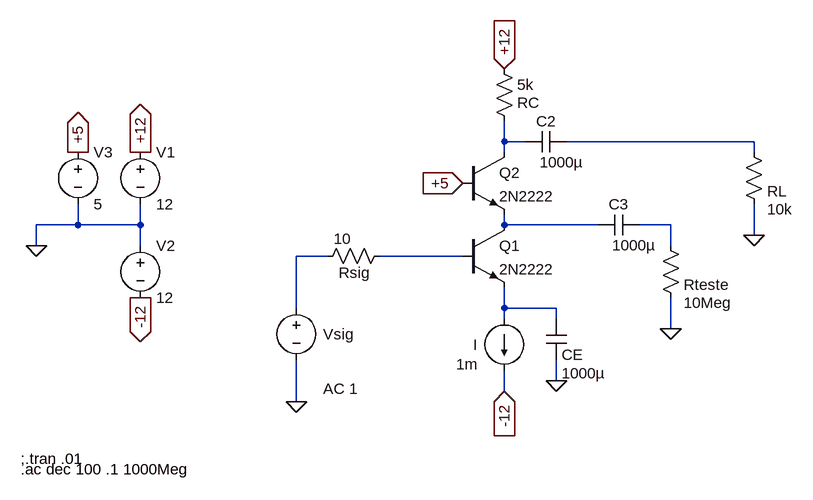
[diagram p0: schematic Cascode TBJ.asc]
Cascode TBJ.asc, the LTspice schematic file:
Version 4
SHEET 1 880 680
WIRE 272 -48 272 -80
WIRE 304 -48 272 -48
WIRE 656 -48 368 -48
WIRE 272 -32 272 -48
WIRE 656 -32 656 -48
WIRE -384 80 -384 48
WIRE -384 80 -448 80
WIRE -288 80 -288 48
WIRE -288 80 -384 80
WIRE 272 80 272 64
WIRE 416 80 272 80
WIRE 528 80 480 80
WIRE 656 96 656 48
WIRE -448 112 -448 80
WIRE -288 112 -288 80
WIRE 528 112 528 80
WIRE 0 128 -48 128
WIRE 208 128 80 128
WIRE -48 208 -48 128
WIRE 272 208 272 176
WIRE 352 208 272 208
WIRE 272 224 272 208
WIRE 352 224 352 208
WIRE 528 240 528 192
WIRE 352 320 352 288
WIRE 272 336 272 304
WIRE -48 352 -48 288
FLAG -48 352 0
FLAG 352 320 0
FLAG 656 96 0
FLAG -448 112 0
FLAG -288 -32 +12
IOPIN -288 -32 Out
FLAG -288 192 -12
IOPIN -288 192 Out
FLAG 272 336 -12
IOPIN 272 336 In
FLAG 272 -160 +12
IOPIN 272 -160 In
FLAG -384 -32 +5
IOPIN -384 -32 Out
FLAG 208 16 +5
IOPIN 208 16 In
FLAG 528 240 0
SYMBOL voltage -48 192 R0
WINDOW 0 41 56 Left 2
WINDOW 3 41 112 Left 2
WINDOW 123 41 140 Left 2
WINDOW 39 0 0 Left 0
SYMATTR InstName Vsig
SYMATTR Value ""
SYMATTR Value2 AC 1
SYMBOL res 96 112 R90
WINDOW 0 57 55 VBottom 2
WINDOW 3 -26 73 VTop 2
SYMATTR InstName Rsig
SYMATTR Value 10
SYMBOL cap 336 224 R0
WINDOW 0 24 56 Left 2
WINDOW 3 24 84 Left 2
SYMATTR InstName CE
SYMATTR Value 1000µ
SYMBOL cap 368 -64 R90
WINDOW 0 0 32 VBottom 2
WINDOW 3 32 8 VTop 2
SYMATTR InstName C2
SYMATTR Value 1000µ
SYMBOL res 256 -176 R0
WINDOW 3 36 40 Left 2
WINDOW 0 36 68 Left 2
SYMATTR Value 5k
SYMATTR InstName RC
SYMBOL res 640 -48 R0
WINDOW 0 36 76 Left 2
WINDOW 3 36 104 Left 2
SYMATTR InstName RL
SYMATTR Value 10k
SYMBOL npn 208 80 R0
SYMATTR InstName Q1
SYMATTR Value 2N2222
SYMBOL npn 208 -32 R0
SYMATTR InstName Q2
SYMATTR Value 2N2222
SYMBOL current 272 224 R0
WINDOW 0 -48 40 Left 2
WINDOW 3 -74 70 Left 2
WINDOW 123 0 0 Left 0
WINDOW 39 0 0 Left 0
SYMATTR InstName I
SYMATTR Value 1m
SYMBOL voltage -288 -48 R0
WINDOW 123 0 0 Left 0
WINDOW 39 0 0 Left 0
SYMATTR InstName V1
SYMATTR Value 12
SYMBOL voltage -288 96 R0
WINDOW 123 0 0 Left 0
WINDOW 39 0 0 Left 0
SYMATTR InstName V2
SYMATTR Value 12
SYMBOL voltage -384 -48 R0
WINDOW 123 0 0 Left 0
WINDOW 39 0 0 Left 0
SYMATTR InstName V3
SYMATTR Value 5
SYMBOL res 512 96 R0
WINDOW 0 36 76 Left 2
WINDOW 3 36 104 Left 2
SYMATTR InstName Rteste
SYMATTR Value 10Meg
SYMBOL cap 480 64 R90
WINDOW 0 0 32 VBottom 2
WINDOW 3 32 8 VTop 2
SYMATTR InstName C3
SYMATTR Value 1000µ
TEXT -472 440 Left 2 !;.tran .01
TEXT -472 456 Left 2 !.ac dec 100 .1 1000Meg

The netlist it stands for:
* Cascode TBJ.asc
Vsig N005 0 AC 1
Rsig N006 N005 10
CE N007 0 1000µ
C2 N002 N001 1000µ
RC +12 N001 5k
RL N002 0 10k
Q1 N003 N006 N007 0 2N2222
Q2 N001 +5 N003 0 2N2222
I N007 -12 1m
V1 +12 0 12
V2 0 -12 12
V3 +5 0 5
Rteste N004 0 10Meg
C3 N004 N003 1000µ
.model NPN NPN
.model PNP PNP
.lib standard.bjt
;.tran .01
.ac dec 100 .1 1000Meg
.backanno
.end